# EAGLE design icboard (EAGLE 9.5.2)
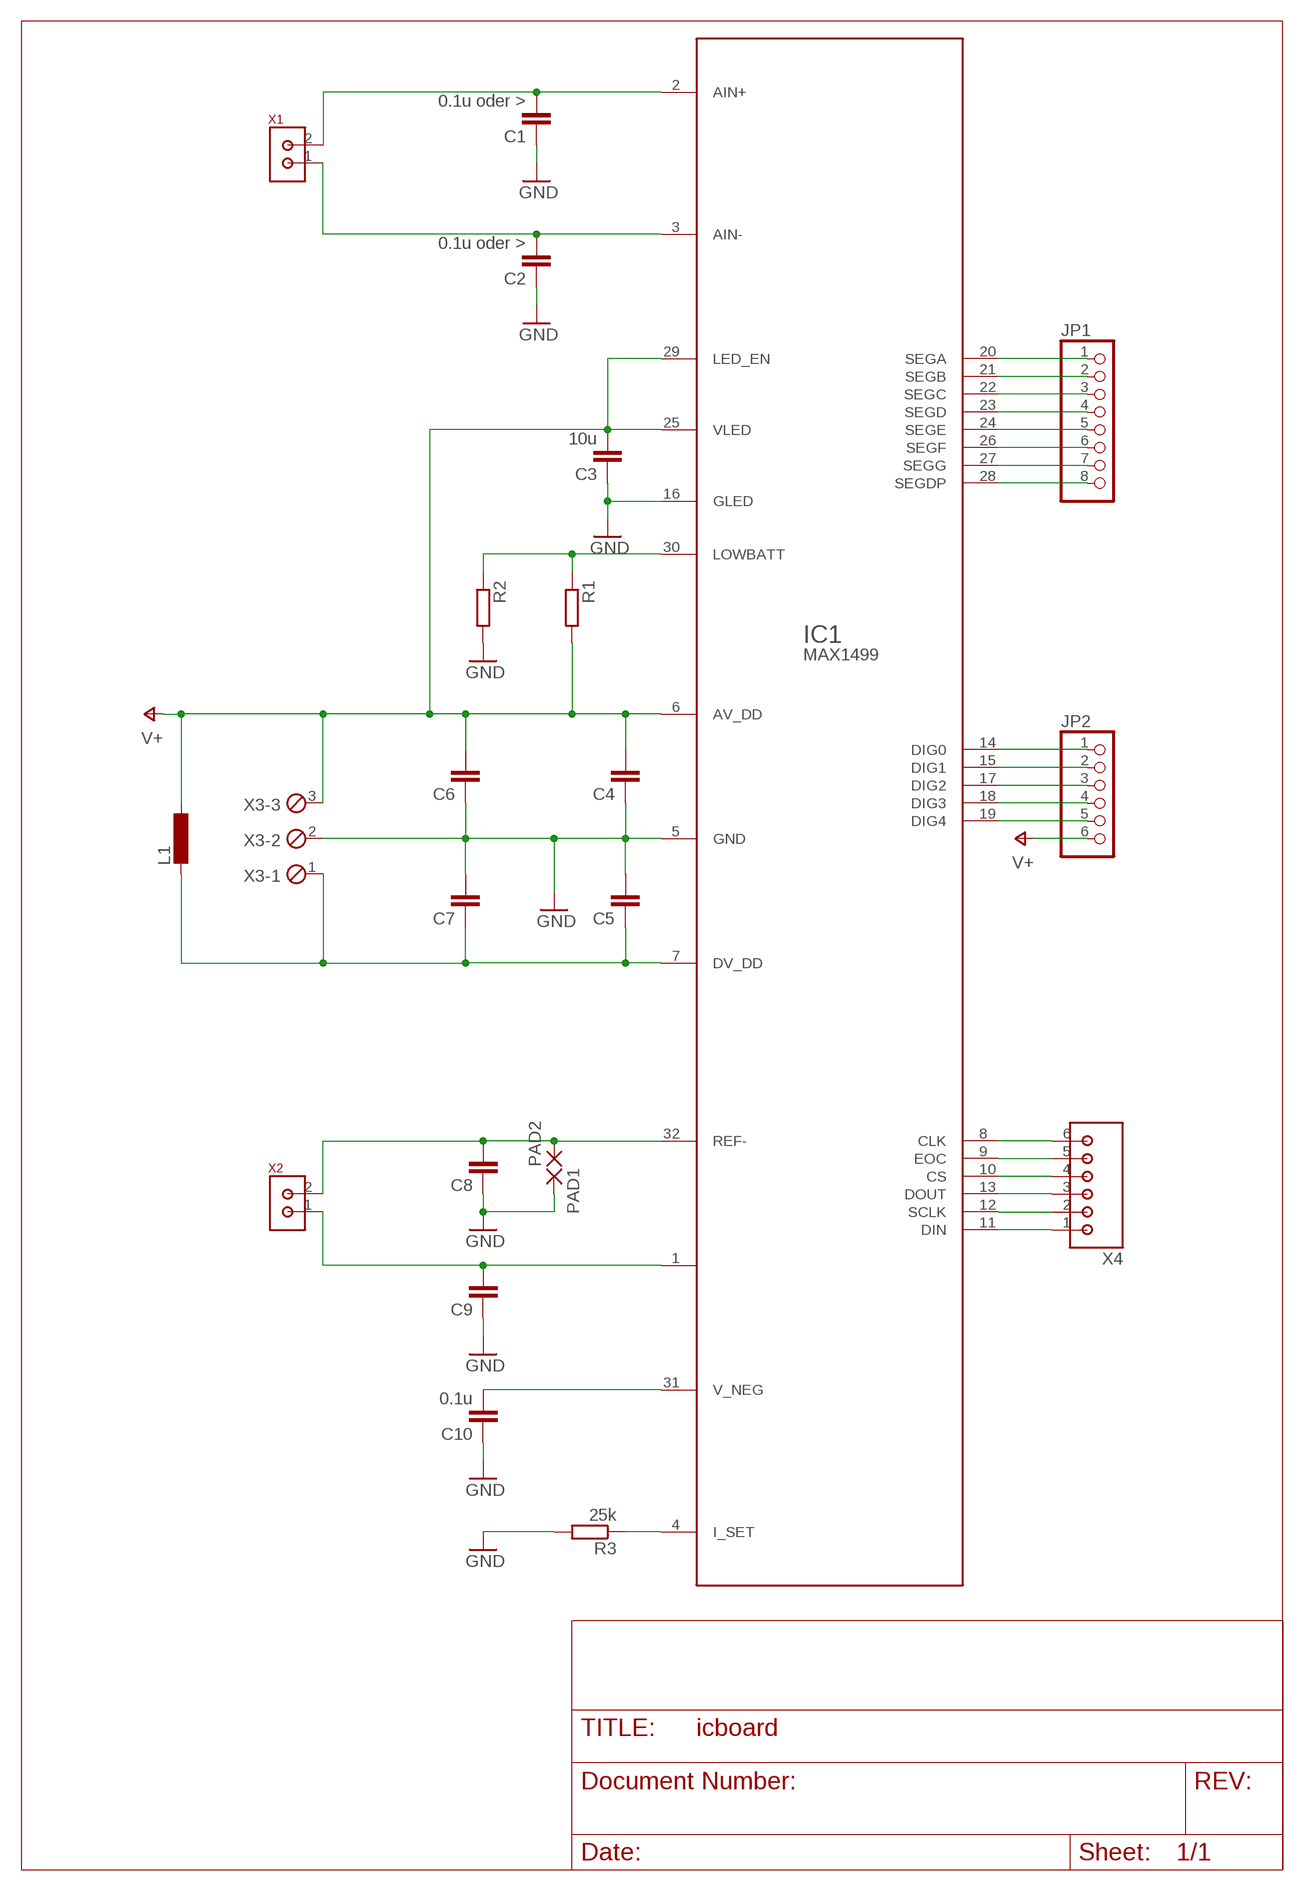
[diagram p0: schematic, sheet 1]

## Parts
C1  0.1u oder >  C-EUC0603  [C0603]
C2  0.1u oder >  C-EUC0603  [C0603]
C3  10u  C-EUC0603  [C0603]
C4  C-EUC0603  [C0603]
C5  C-EUC0603  [C0603]
C6  C-EUC0603  [C0603]
C7  C-EUC0603  [C0603]
C8  C-EUC0603  [C0603]
C9  C-EUC0603  [C0603]
C10  0.1u  C-EUC0603  [C0603]
IC1  MAX1499  [TQFP32-08]
JP1  PINHD-1X8  [1X08]
JP2  PINHD-1X6  [1X06]
L1  L-EUL1812  [L1812]
PAD1  SMD2  [SMD1,27-2,54]
PAD2  SMD2  [SMD1,27-2,54]
R1  R-EU_R0603  [R0603]
R2  R-EU_R0603  [R0603]
R3  25k  R-EU_R0603  [R0603]
X1  MOLEX_CON2_2P  [CON2_2P]
X2  MOLEX_CON2_2P  [CON2_2P]
X3  MPT3  [3POL254]
X4  MOLEX_CON2_6P  [CON2_6P]

## Nets
GND: C1.1 C2.1 C3.1 C4.1 C5.2 C6.1 C7.2 C8.1 C9.1 C10.1 IC1.5(GND) IC1.16(GLED) PAD1.1(P) R2.2 R3.2 X3.2
N$1: C1.2 IC1.2(AIN+) X1.2
N$2: C2.2 IC1.3(AIN-) X1.1
N$4: IC1.17(DIG2) JP2.3
N$5: IC1.30(LOWBATT) R1.1 R2.1
N$6: C5.1 C7.1 IC1.7(DV_DD) L1.2 X3.1
N$7: C8.2 IC1.32(REF-) PAD2.1(P) X2.2
N$8: C9.2 IC1.1(REF+) X2.1
N$9: IC1.4(I_SET) R3.1
N$10: C10.2 IC1.31(V_NEG)
N$11: IC1.20(SEGA) JP1.1
N$12: IC1.21(SEGB) JP1.2
N$13: IC1.22(SEGC) JP1.3
N$14: IC1.23(SEGD) JP1.4
N$15: IC1.24(SEGE) JP1.5
N$16: IC1.26(SEGF) JP1.6
N$17: IC1.27(SEGG) JP1.7
N$18: IC1.28(SEGDP) JP1.8
N$19: IC1.14(DIG0) JP2.1
N$20: IC1.15(DIG1) JP2.2
N$21: IC1.18(DIG3) JP2.4
N$22: IC1.19(DIG4) JP2.5
N$31: IC1.9(EOC) X4.5
N$32: IC1.13(DOUT) X4.3
N$38: IC1.12(SCLK) X4.2
N$39: IC1.10(CS) X4.4
N$40: IC1.11(DIN) X4.1
N$41: IC1.8(CLK) X4.6
V+: C3.2 C4.2 C6.2 IC1.6(AV_DD) IC1.25(VLED) IC1.29(LED_EN) JP2.6 L1.1 R1.2 X3.3

## Library data of the parts
C1-C10 = rcl:C-EU: CAPACITOR, European symbol
IC1 = LEDVoltmeter:MAX1499
JP1 = pinhead:PINHD-1X8: PIN HEADER
JP2 = pinhead:PINHD-1X6: PIN HEADER
L1 = rcl:L-EU: INDUCTOR, European symbol
PAD1 PAD2 = wirepad:SMD2: SMD PAD
R1-R3 = rcl:R-EU_: RESISTOR, European symbol
X1 X2 = Lib_Eis_HSW:MOLEX_CON2_2P: MOLEX2
X3 = con-phoenix-254:MPT3: PHOENIX CONNECTOR; OC_FARNELL: unknown; OC_NEWARK: unknown
X4 = Lib_Eis_HSW:MOLEX_CON2_6P

## Board
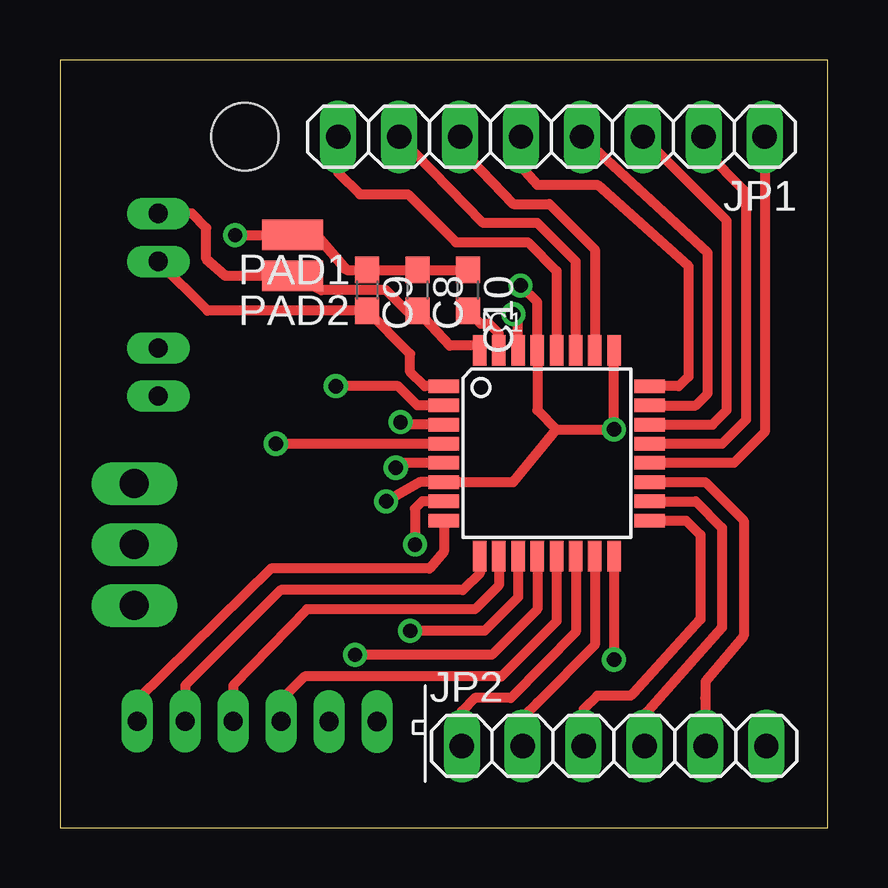
[diagram p1: board, top side]
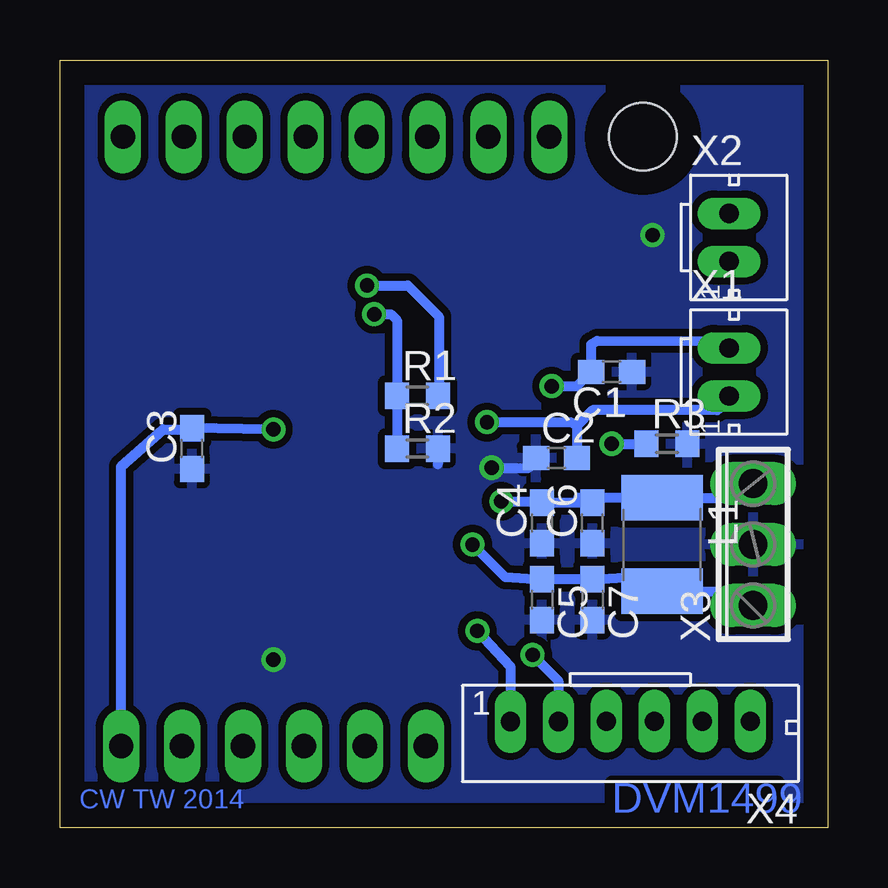
[diagram p2: board, bottom side, seen from below]

Size 32 x 32 mm. Coordinates in mm from the lower left corner, seen from the top.
Outline: 0,0 32,0 32,32 0,32 0,0
Copper layers (1*16): Top 0.035mm / dielectric 1.5mm / Bottom 0.035mm
Design rules "eigene_max1499": minimum track width 10mil, minimum drill 23mil, track to track 6mil, track to pad 6mil, pad to pad 6mil, via to via 6mil, smd to smd 6mil, copper to edge 40mil, drill to drill 8mil, minimum pad ring 10mil, minimum via ring 8mil, stop-mask expansion 4mil, vias tented up to drill 0mil, thermal gap 10mil
Holes 2.8 mm at 7.7,28.8

### Footprints (pad centres in the part's own frame; a part is rotated, then mirrored left to right if it is on the bottom)
C0603 = smd 1.1 x 1: 1 -0.85,0; 2 0.85,0
TQFP32-08 = smd 1.27 x 0.559: 1 -4.293,2.8; 2 -4.293,2; 3 -4.293,1.2; 4 -4.293,0.4; 5 -4.293,-0.4; 6 -4.293,-1.2; 7 -4.293,-2; 8 -4.293,-2.8; 17 4.293,-2.8; 18 4.293,-2; 19 4.293,-1.2; 20 4.293,-0.4; 21 4.293,0.4; 22 4.293,1.2; 23 4.293,2; 24 4.293,2.8 | smd 0.559 x 1.27: 9 -2.8,-4.293; 10 -2,-4.293; 11 -1.2,-4.293; 12 -0.4,-4.293; 13 0.4,-4.293; 14 1.2,-4.293; 15 2,-4.293; 16 2.8,-4.293; 25 2.8,4.293; 26 2,4.293; 27 1.2,4.293; 28 0.4,4.293; 29 -0.4,4.293; 30 -1.2,4.293; 31 -2,4.293; 32 -2.8,4.293
1X08 = drill 1.016 long: 1 -8.89,0; 2 -6.35,0; 3 -3.81,0; 4 -1.27,0; 5 1.27,0; 6 3.81,0; 7 6.35,0; 8 8.89,0
1X06 = drill 1.016 long: 1 -6.35,0; 2 -3.81,0; 3 -1.27,0; 4 1.27,0; 5 3.81,0; 6 6.35,0
L1812 = smd 1.9 x 3.4: 1 -1.95,0; 2 1.95,0
SMD1,27-2,54 = smd 1.27 x 2.54: 1 0,0
R0603 = smd 1 x 1.1: 1 -0.85,0; 2 0.85,0
CON2_2P = drill 0.8 long: 1 0,0; 2 0,2
3POL254 = drill 1.2 long: 1 -2.54,0; 2 0,0; 3 2.54,0
CON2_6P = drill 0.8 pad 1.27 long: 1 5,0.01; 2 3,0.01; 3 1,0; 4 -1,0; 5 -3,0; 6 -5,0

### Placement (x,y rotation side)
C1  9,19 180 bottom
C2  11.3,15.4 0 bottom
C3  26.5,15.8 90 bottom
C4  11.9,12.7 90 bottom
C5  11.9,9.5 270 bottom
C6  9.8,12.7 90 bottom
C7  9.8,9.5 270 bottom
C8  14.9,22.4 270 top
C9  12.8,22.4 270 top
C10  17,22.4 270 top
IC1  20.3,15.6 0 top
JP1  20.49,28.8 180 top
JP2  23.1,3.4 0 top
L1  6.9,11.8 270 bottom
PAD1  9.7,24.7 90 top
PAD2  9.7,23 90 top
R1  17.1,18 0 bottom
R2  17.1,15.8 0 bottom
R3  6.7,16 0 bottom
X1  4.1,17.99 0 bottom
X2  4.1,23.6 0 bottom
X3  3.1,11.8 90 bottom
X4  8.22,4.43 180 bottom

### Tracks (layer width: path | path; a pad name or v marks a point on that pad's centre or on a via)
GND  (via drill 0.6)
  Top 0.406: C9.1 C8.1 C10.1 | IC1.16 v23.1,7 | IC1.5 14.2,15.2 v14,15 | C9.1 12.75,23.3 | C9.1 11.95,23.25 10.7,24.7 PAD1.1 v7.3,24.7
  Bottom 0.406: v14,15 12.45,15 C2.1 | R2.2 16.25,15.15
  pour Bottom (isolate 0.305): 0,32 32,32 32,0 0,0
N$1  (via drill 0.6)
  Top 0.406: IC1.2 14.9,17.6 14.1,18.4 v11.5,18.4
  Bottom 0.406: v11.5,18.4 10.45,18.4 C1.2 9.85,20.15 9.61,20.29 4.5,20.3 4.4,20.3 X1.2
N$2  (via drill 0.6)
  Top 0.406: IC1.3 14.4,16.8 v14.2,16.9
  Bottom 0.406: 10.45,16.75 9.8,17.4 4.6,17.4 X1.1 | 10.45,16.75 C2.2 | v14.2,16.9 10.7,16.9 10.45,16.75
N$4
  Top 0.406: IC1.17 26.1,12.8 26.7,12.2 26.7,8.67 23.9,5.6 23.8,5.5 22.4,5.5 21.83,4.93 JP2.3
N$5  (via drill 0.6)
  Top 0.406: IC1.30 19.1,21.2 v18.9,21.4
  Bottom 0.406: R2.1 R1.1 17.95,21.15 18.2,21.4 v18.9,21.4
N$6  (via drill 0.6)
  Top 0.406: IC1.7 15.1,13.6 14.8,13.3 v14.8,11.8
  Bottom 0.406: X3.1 3.49,9.85 L1.2 8.1,10.45 C7.1 C5.1 13.45,10.45 v14.8,11.8
N$7
  Top 0.406: IC1.32 17.3,20.09 16.26,20.09 C8.2 14.45,21.55 13.6,22.4 10.9,22.4 PAD2.1 6.9,23 6.1,23.7 6.1,25 5.5,25.6 X2.2
N$8
  Top 0.406: IC1.1 15.2,18.4 14.6,19 14.6,19.75 C9.2 6.15,21.55 X2.1
N$9  (via drill 0.6)
  Top 0.406: IC1.4 v9,16
  Bottom 0.406: v9,16 R3.1
N$10
  Top 0.406: IC1.31 18.3,20.6 17.9,21 17.55,21 C10.2
N$11
  Top 0.406: JP1.1 29.38,16.48 28.1,15.2 IC1.20
N$12
  Top 0.406: JP1.2 26.84,28.26 28.6,26.5 28.6,17 27.6,16 IC1.21
N$13
  Top 0.406: IC1.22 27.2,16.8 27.8,17.4 27.8,25.3 JP1.3
N$14
  Top 0.406: IC1.23 26.5,17.6 27,18.1 27,23.96 JP1.4
N$15
  Top 0.406: JP1.5 19.22,27.58 19.9,26.8 22.4,26.8 26.2,23.4 26.2,18.8 25.8,18.4 IC1.24
N$16
  Top 0.406: JP1.6 16.68,28.32 18.9,26 20.4,26 22.3,24.1 IC1.26
N$17
  Top 0.406: IC1.27 21.5,23.6 19.9,25.2 17.64,25.2 JP1.7
N$18
  Top 0.406: JP1.8 11.6,27.3 12.5,26.4 14.5,26.4 16.5,24.4 19.5,24.4 20.7,23.2 IC1.28
N$19
  Top 0.406: IC1.14 21.5,8.15 18.8,5.4 17.3,5.4 16.75,4.85 JP2.1
N$20
  Top 0.406: IC1.15 22.3,7.61 19.9,5.2 19.29,4.59 JP2.2
N$21
  Top 0.406: IC1.18 26.5,13.6 27.6,12.5 27.6,8.33 25.8,6.3 24.37,4.67 JP2.4
N$22
  Top 0.406: IC1.19 26.9,14.4 28.5,12.8 28.5,7.99 26.91,6.09 26.9,5.4 JP2.5
N$31
  Top 0.406: IC1.9 17.5,10.6 16.8,9.9 9.2,9.9 5.22,5.92 X4.5
N$32
  Top 0.406: IC1.13 20.7,8.6 18.4,6.3 10.2,6.3 9.22,5.32 X4.3
N$38  (via drill 0.6)
  Top 0.406: IC1.12 19.9,9.1 18,7.2 v12.3,7.2
  Bottom 0.406: v12.3,7.2 11.22,6.12 X4.2
N$39
  Top 0.406: IC1.10 18.3,10.1 17.3,9.1 10.3,9.1 7.22,5.92 X4.4
N$40  (via drill 0.6)
  Top 0.406: IC1.11 19.1,9.6 17.7,8.2 v14.6,8.2
  Bottom 0.406: v14.6,8.2 13.22,6.72 X4.1
N$41
  Top 0.406: IC1.8 16.01,11.51 15.4,10.8 8.8,10.8 3.22,5.32 X4.6
V+  (via drill 0.6)
  Top 0.406: 20.7,16.6 18.9,14.4 IC1.6 15,14.4 v13.6,13.6 | 20.7,16.6 v23.1,16.6 IC1.25 | 20.7,16.6 19.9,17.4 IC1.29 19.9,21.9 v19.2,22.6
  Bottom 0.406: JP2.6 29.45,15.05 27.7,16.6 26.55,16.6 C3.2 23.35,16.6 v23.1,16.6 | X3.3 3.89,13.75 L1.1 10.4,13.75 C6.2 C4.2 11.95,13.6 v13.6,13.6 | v19.2,22.6 17.5,22.6 16.2,21.3 16.2,18.05 R1.2

### Text on the board
Bottom: DVM1499 | CW TW 2014